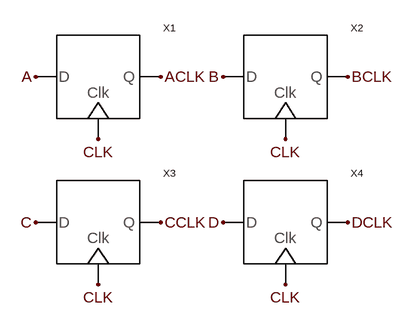
[diagram p0: schematic D_FF4.asc]
D_FF4.asc, the LTspice schematic file:
Version 4
SHEET 1 880 972
FLAG -144 640 CLK
FLAG 144 640 CLK
FLAG -144 864 CLK
FLAG 144 864 CLK
FLAG -240 544 A
FLAG 48 544 B
FLAG -240 768 C
FLAG 48 768 D
FLAG -48 544 ACLK
FLAG 240 544 BCLK
FLAG -48 768 CCLK
FLAG 240 768 DCLK
SYMBOL D_FF -144 544 R0
SYMATTR InstName X1
SYMBOL D_FF 144 544 R0
SYMATTR InstName X2
SYMBOL D_FF -144 768 R0
SYMATTR InstName X3
SYMBOL D_FF 144 768 R0
SYMATTR InstName X4

The netlist it stands for:
* D_FF4.asc
XX1 A ACLK CLK D_FF  ; pins D Q clock
XX2 B BCLK CLK D_FF  ; pins D Q clock
XX3 C CCLK CLK D_FF  ; pins D Q clock
XX4 D DCLK CLK D_FF  ; pins D Q clock
.backanno
.end